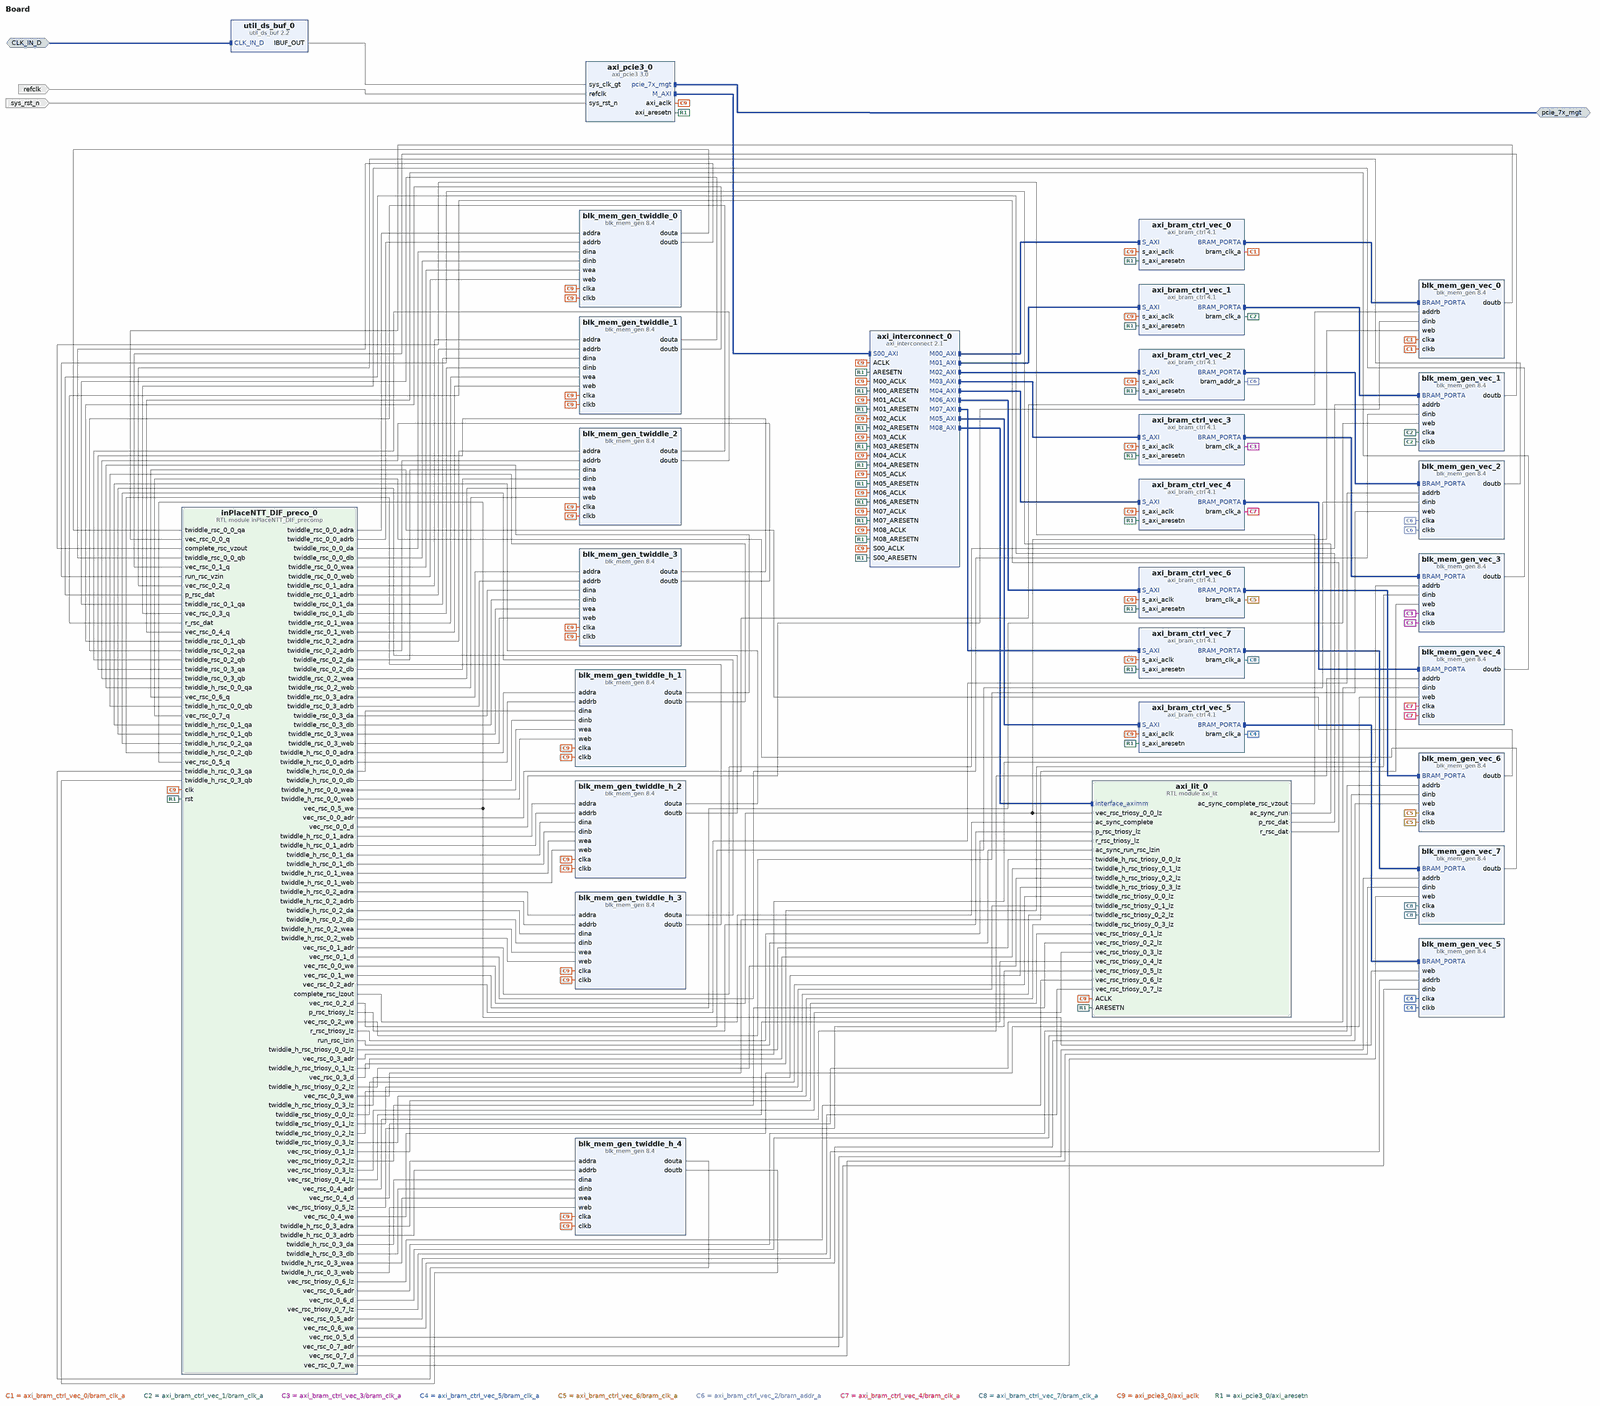
[diagram p0: block diagram of the top level, whole]
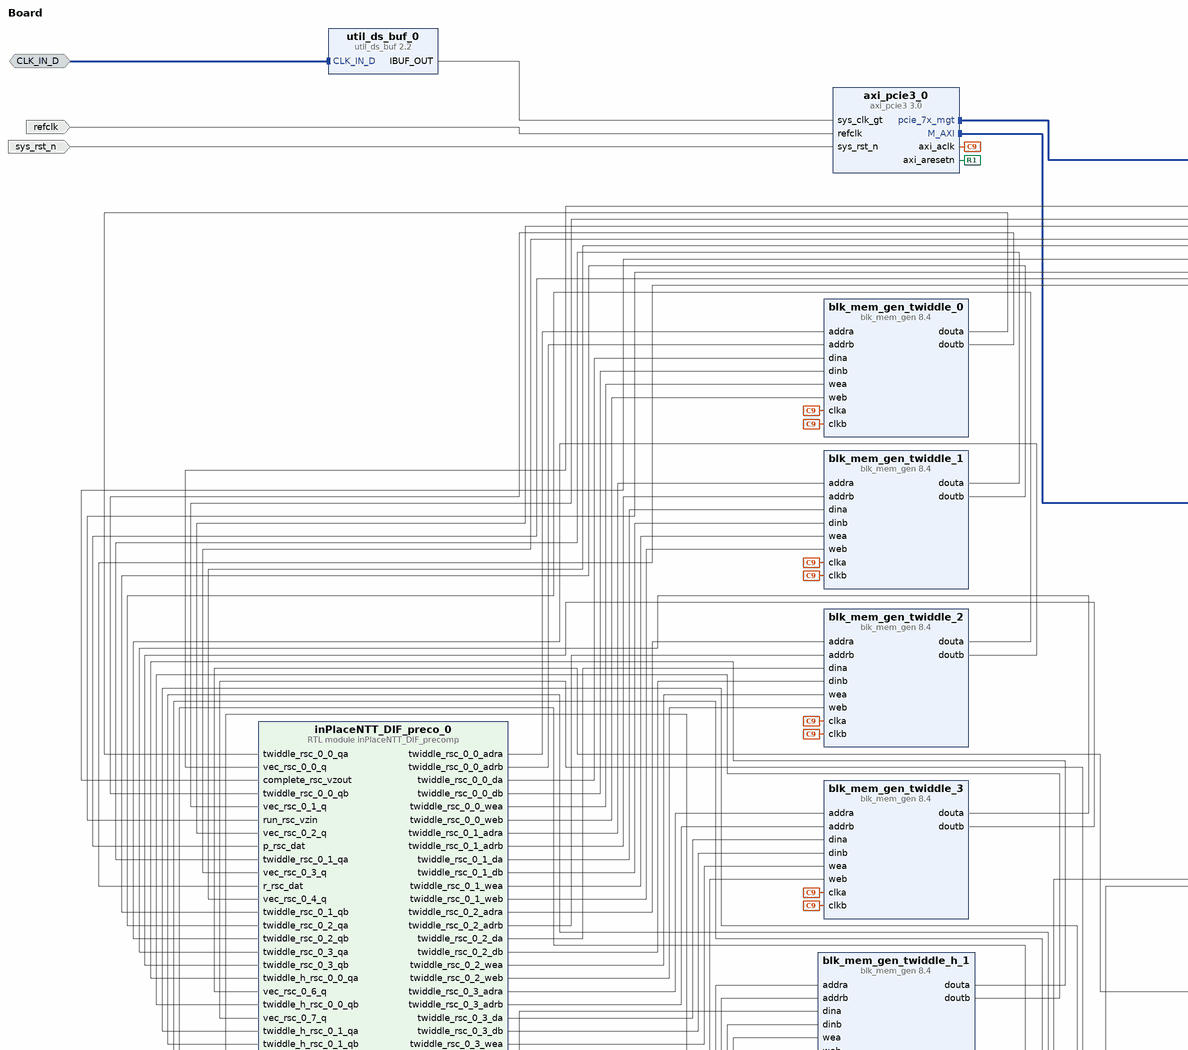
[diagram p1: block diagram of the top level, upper left part]
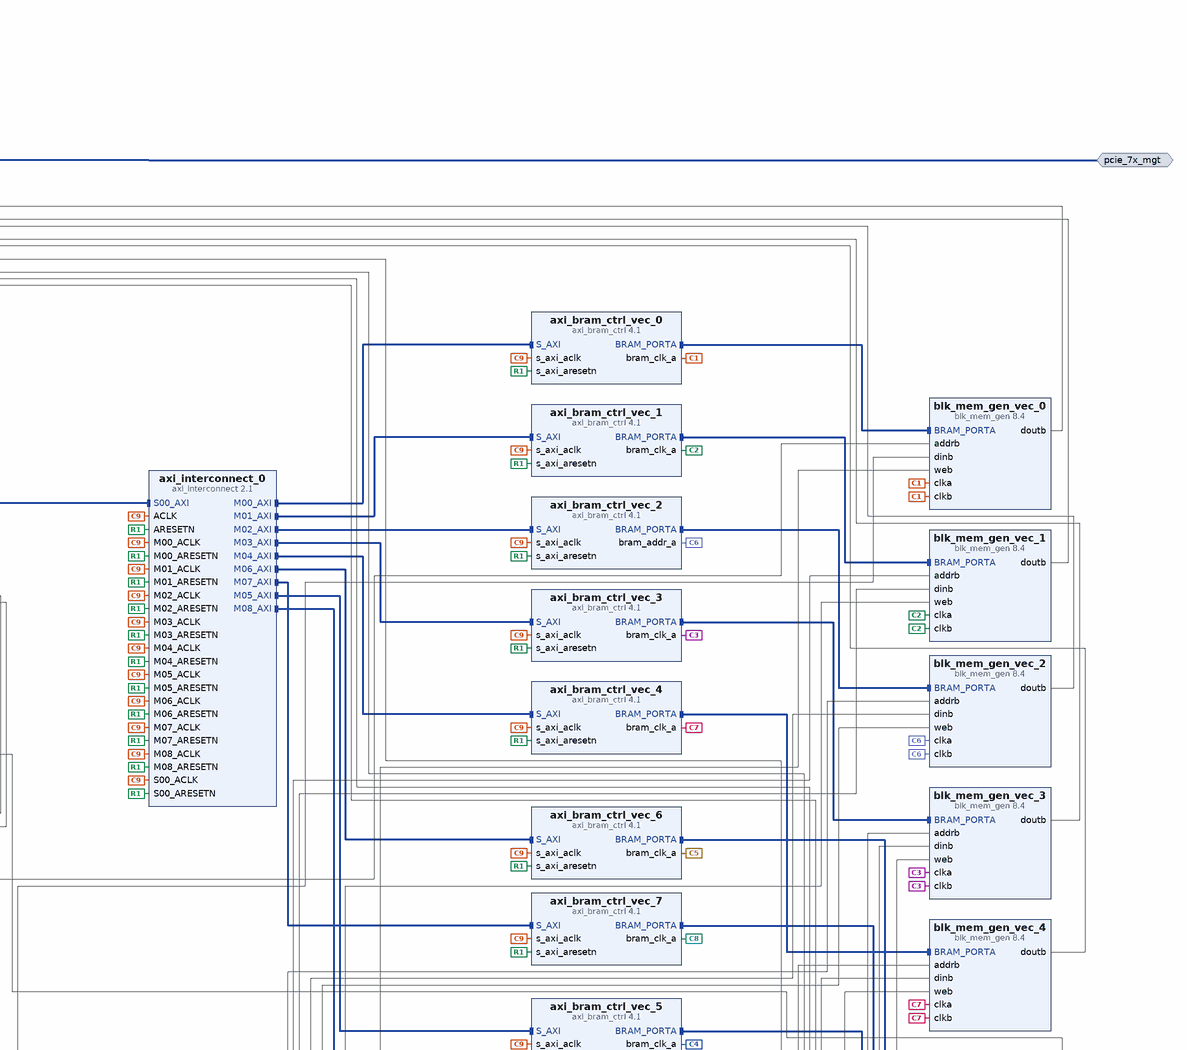
[diagram p2: block diagram of the top level, upper right part]
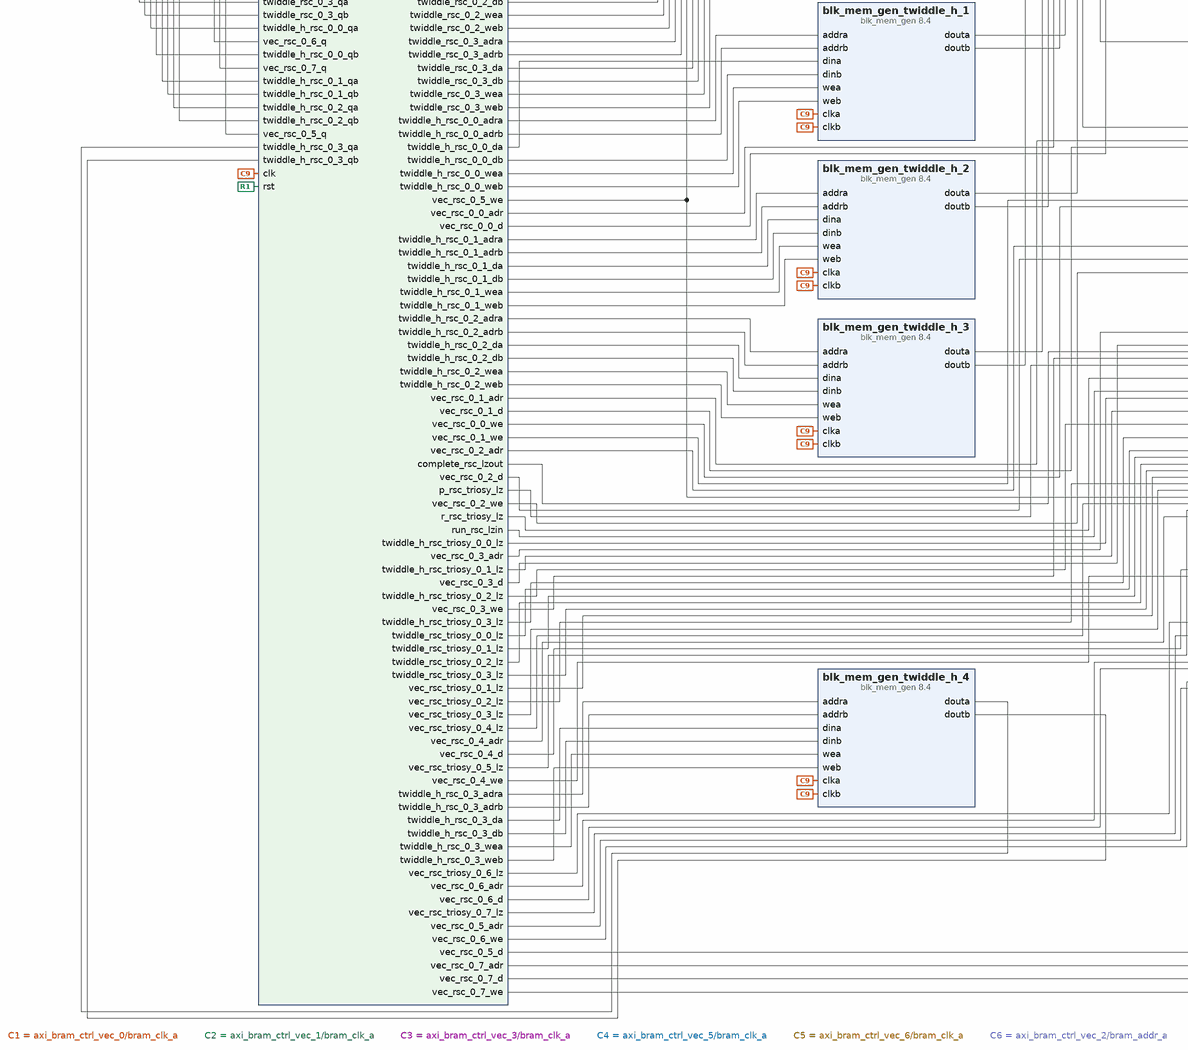
[diagram p3: block diagram of the top level, lower left part]
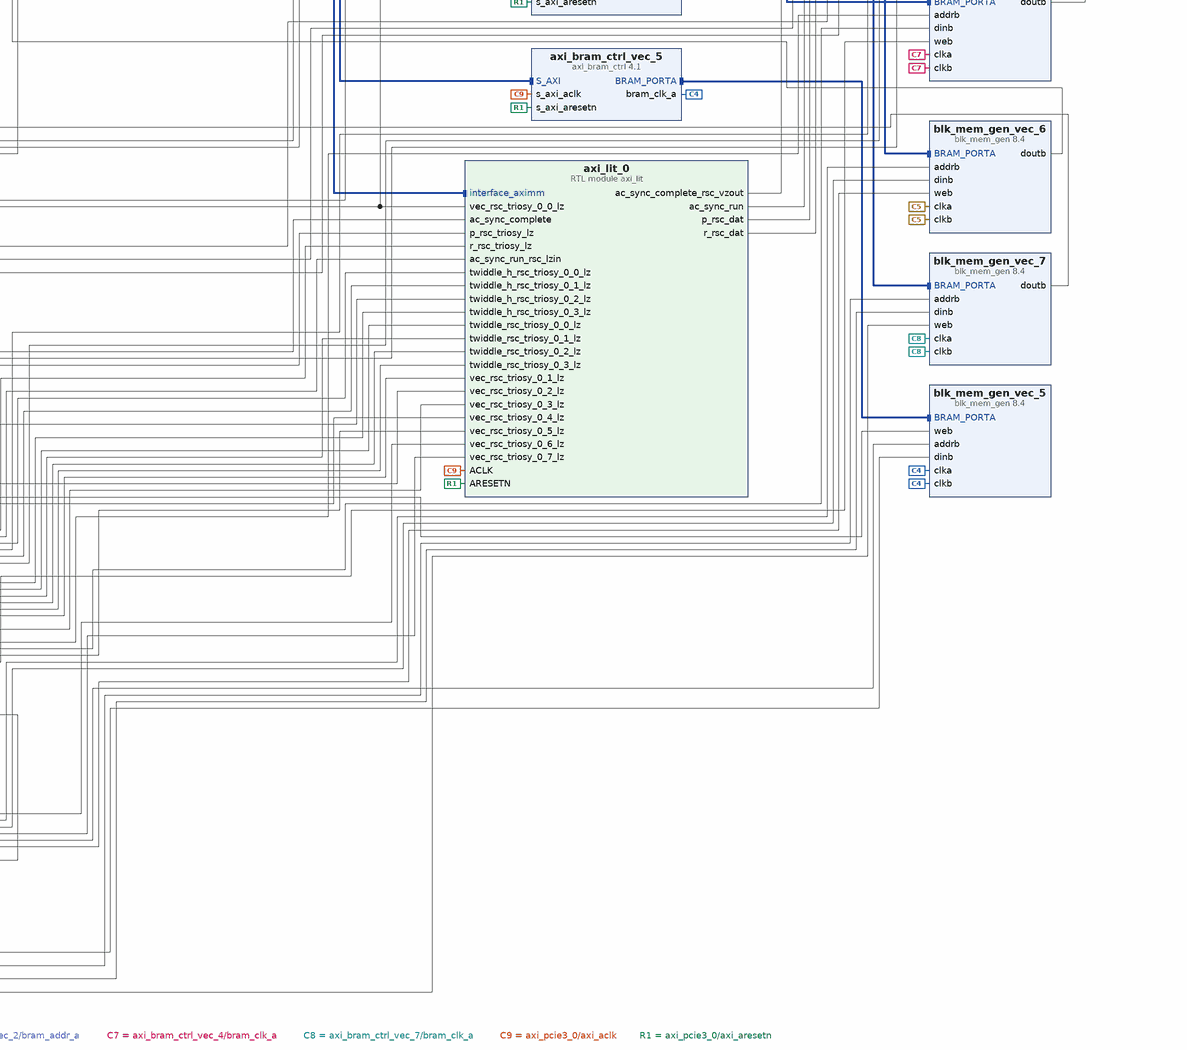
[diagram p4: block diagram of the top level, lower right part]
# Vivado block design Board, xcku115-flvb2104-2-e, Vivado 2021.1
create_bd_design Board

create_bd_intf_port -mode Master -vlnv xilinx.com:interface:pcie_7x_mgt_rtl:1.0 pcie_7x_mgt
create_bd_intf_port -mode Slave -vlnv xilinx.com:interface:diff_clock_rtl:1.0 CLK_IN_D
create_bd_port -dir I -type clk refclk
set_property -dict {CONFIG.FREQ_HZ 100000000} [get_bd_ports refclk]
create_bd_port -dir I -type rst sys_rst_n

create_bd_cell -type ip -vlnv xilinx.com:ip:axi_pcie3:3.0 axi_pcie3_0
create_bd_cell -type ip -vlnv xilinx.com:ip:axi_interconnect:2.1 axi_interconnect_0
set_property -dict {CONFIG.NUM_MI 9} [get_bd_cells axi_interconnect_0]
create_bd_cell -type ip -vlnv xilinx.com:ip:util_ds_buf:2.2 util_ds_buf_0
create_bd_cell -type ip -vlnv xilinx.com:ip:axi_bram_ctrl:4.1 axi_bram_ctrl_vec_0
set_property -dict {CONFIG.SINGLE_PORT_BRAM 1} [get_bd_cells axi_bram_ctrl_vec_0]
create_bd_cell -type ip -vlnv xilinx.com:ip:blk_mem_gen:8.4 blk_mem_gen_vec_0
set_property -dict [list \
  CONFIG.Enable_32bit_Address false \
  CONFIG.Enable_A Always_Enabled \
  CONFIG.Enable_B Always_Enabled \
  CONFIG.Memory_Type True_Dual_Port_RAM \
  CONFIG.Operating_Mode_A READ_FIRST \
  CONFIG.Operating_Mode_B READ_FIRST \
  CONFIG.Port_B_Clock 100 \
  CONFIG.Port_B_Enable_Rate 100 \
  CONFIG.Port_B_Write_Rate 50 \
  CONFIG.Register_PortA_Output_of_Memory_Primitives true \
  CONFIG.Register_PortB_Output_of_Memory_Primitives true \
  CONFIG.Use_Byte_Write_Enable false \
  CONFIG.Use_RSTA_Pin false \
  CONFIG.use_bram_block Stand_Alone \
] [get_bd_cells blk_mem_gen_vec_0]
create_bd_cell -type module -reference inPlaceNTT_DIF_precomp inPlaceNTT_DIF_preco_0
create_bd_cell -type ip -vlnv xilinx.com:ip:axi_bram_ctrl:4.1 axi_bram_ctrl_vec_1
set_property -dict {CONFIG.SINGLE_PORT_BRAM 1} [get_bd_cells axi_bram_ctrl_vec_1]
create_bd_cell -type ip -vlnv xilinx.com:ip:blk_mem_gen:8.4 blk_mem_gen_vec_1
set_property -dict [list \
  CONFIG.Enable_32bit_Address false \
  CONFIG.Enable_A Always_Enabled \
  CONFIG.Enable_B Always_Enabled \
  CONFIG.Memory_Type True_Dual_Port_RAM \
  CONFIG.Operating_Mode_A READ_FIRST \
  CONFIG.Operating_Mode_B READ_FIRST \
  CONFIG.Port_B_Clock 100 \
  CONFIG.Port_B_Enable_Rate 100 \
  CONFIG.Port_B_Write_Rate 50 \
  CONFIG.Register_PortA_Output_of_Memory_Primitives true \
  CONFIG.Register_PortB_Output_of_Memory_Primitives true \
  CONFIG.Use_Byte_Write_Enable false \
  CONFIG.Use_RSTA_Pin false \
  CONFIG.use_bram_block Stand_Alone \
] [get_bd_cells blk_mem_gen_vec_1]
create_bd_cell -type ip -vlnv xilinx.com:ip:axi_bram_ctrl:4.1 axi_bram_ctrl_vec_2
set_property -dict {CONFIG.SINGLE_PORT_BRAM 1} [get_bd_cells axi_bram_ctrl_vec_2]
create_bd_cell -type ip -vlnv xilinx.com:ip:blk_mem_gen:8.4 blk_mem_gen_vec_2
set_property -dict [list \
  CONFIG.Enable_32bit_Address false \
  CONFIG.Enable_A Always_Enabled \
  CONFIG.Enable_B Always_Enabled \
  CONFIG.Memory_Type True_Dual_Port_RAM \
  CONFIG.Operating_Mode_A READ_FIRST \
  CONFIG.Operating_Mode_B READ_FIRST \
  CONFIG.Port_B_Clock 100 \
  CONFIG.Port_B_Enable_Rate 100 \
  CONFIG.Port_B_Write_Rate 50 \
  CONFIG.Register_PortA_Output_of_Memory_Primitives true \
  CONFIG.Register_PortB_Output_of_Memory_Primitives true \
  CONFIG.Use_Byte_Write_Enable false \
  CONFIG.Use_RSTA_Pin false \
  CONFIG.use_bram_block Stand_Alone \
] [get_bd_cells blk_mem_gen_vec_2]
create_bd_cell -type ip -vlnv xilinx.com:ip:axi_bram_ctrl:4.1 axi_bram_ctrl_vec_3
set_property -dict {CONFIG.SINGLE_PORT_BRAM 1} [get_bd_cells axi_bram_ctrl_vec_3]
create_bd_cell -type ip -vlnv xilinx.com:ip:blk_mem_gen:8.4 blk_mem_gen_vec_3
set_property -dict [list \
  CONFIG.Enable_32bit_Address false \
  CONFIG.Enable_A Always_Enabled \
  CONFIG.Enable_B Always_Enabled \
  CONFIG.Memory_Type True_Dual_Port_RAM \
  CONFIG.Operating_Mode_A READ_FIRST \
  CONFIG.Operating_Mode_B READ_FIRST \
  CONFIG.Port_B_Clock 100 \
  CONFIG.Port_B_Enable_Rate 100 \
  CONFIG.Port_B_Write_Rate 50 \
  CONFIG.Register_PortA_Output_of_Memory_Primitives true \
  CONFIG.Register_PortB_Output_of_Memory_Primitives true \
  CONFIG.Use_Byte_Write_Enable false \
  CONFIG.Use_RSTA_Pin false \
  CONFIG.use_bram_block Stand_Alone \
] [get_bd_cells blk_mem_gen_vec_3]
create_bd_cell -type ip -vlnv xilinx.com:ip:axi_bram_ctrl:4.1 axi_bram_ctrl_vec_4
set_property -dict {CONFIG.SINGLE_PORT_BRAM 1} [get_bd_cells axi_bram_ctrl_vec_4]
create_bd_cell -type ip -vlnv xilinx.com:ip:blk_mem_gen:8.4 blk_mem_gen_vec_4
set_property -dict [list \
  CONFIG.Enable_32bit_Address false \
  CONFIG.Enable_A Always_Enabled \
  CONFIG.Enable_B Always_Enabled \
  CONFIG.Memory_Type True_Dual_Port_RAM \
  CONFIG.Operating_Mode_A READ_FIRST \
  CONFIG.Operating_Mode_B READ_FIRST \
  CONFIG.Port_B_Clock 100 \
  CONFIG.Port_B_Enable_Rate 100 \
  CONFIG.Port_B_Write_Rate 50 \
  CONFIG.Register_PortA_Output_of_Memory_Primitives true \
  CONFIG.Register_PortB_Output_of_Memory_Primitives true \
  CONFIG.Use_Byte_Write_Enable false \
  CONFIG.Use_RSTA_Pin false \
  CONFIG.use_bram_block Stand_Alone \
] [get_bd_cells blk_mem_gen_vec_4]
create_bd_cell -type ip -vlnv xilinx.com:ip:axi_bram_ctrl:4.1 axi_bram_ctrl_vec_5
set_property -dict {CONFIG.SINGLE_PORT_BRAM 1} [get_bd_cells axi_bram_ctrl_vec_5]
create_bd_cell -type ip -vlnv xilinx.com:ip:blk_mem_gen:8.4 blk_mem_gen_vec_5
set_property -dict [list \
  CONFIG.Enable_32bit_Address false \
  CONFIG.Enable_A Always_Enabled \
  CONFIG.Enable_B Always_Enabled \
  CONFIG.Memory_Type True_Dual_Port_RAM \
  CONFIG.Operating_Mode_A READ_FIRST \
  CONFIG.Operating_Mode_B READ_FIRST \
  CONFIG.Port_B_Clock 100 \
  CONFIG.Port_B_Enable_Rate 100 \
  CONFIG.Port_B_Write_Rate 50 \
  CONFIG.Register_PortA_Output_of_Memory_Primitives true \
  CONFIG.Register_PortB_Output_of_Memory_Primitives true \
  CONFIG.Use_Byte_Write_Enable false \
  CONFIG.Use_RSTA_Pin false \
  CONFIG.use_bram_block Stand_Alone \
] [get_bd_cells blk_mem_gen_vec_5]
create_bd_cell -type ip -vlnv xilinx.com:ip:axi_bram_ctrl:4.1 axi_bram_ctrl_vec_6
set_property -dict {CONFIG.SINGLE_PORT_BRAM 1} [get_bd_cells axi_bram_ctrl_vec_6]
create_bd_cell -type ip -vlnv xilinx.com:ip:blk_mem_gen:8.4 blk_mem_gen_vec_6
set_property -dict [list \
  CONFIG.Enable_32bit_Address false \
  CONFIG.Enable_A Always_Enabled \
  CONFIG.Enable_B Always_Enabled \
  CONFIG.Memory_Type True_Dual_Port_RAM \
  CONFIG.Operating_Mode_A READ_FIRST \
  CONFIG.Operating_Mode_B READ_FIRST \
  CONFIG.Port_B_Clock 100 \
  CONFIG.Port_B_Enable_Rate 100 \
  CONFIG.Port_B_Write_Rate 50 \
  CONFIG.Register_PortA_Output_of_Memory_Primitives true \
  CONFIG.Register_PortB_Output_of_Memory_Primitives true \
  CONFIG.Use_Byte_Write_Enable false \
  CONFIG.Use_RSTA_Pin false \
  CONFIG.use_bram_block Stand_Alone \
] [get_bd_cells blk_mem_gen_vec_6]
create_bd_cell -type ip -vlnv xilinx.com:ip:axi_bram_ctrl:4.1 axi_bram_ctrl_vec_7
set_property -dict {CONFIG.SINGLE_PORT_BRAM 1} [get_bd_cells axi_bram_ctrl_vec_7]
create_bd_cell -type ip -vlnv xilinx.com:ip:blk_mem_gen:8.4 blk_mem_gen_vec_7
set_property -dict [list \
  CONFIG.Enable_32bit_Address false \
  CONFIG.Enable_A Always_Enabled \
  CONFIG.Enable_B Always_Enabled \
  CONFIG.Memory_Type True_Dual_Port_RAM \
  CONFIG.Operating_Mode_A READ_FIRST \
  CONFIG.Operating_Mode_B READ_FIRST \
  CONFIG.Port_B_Clock 100 \
  CONFIG.Port_B_Enable_Rate 100 \
  CONFIG.Port_B_Write_Rate 50 \
  CONFIG.Register_PortA_Output_of_Memory_Primitives true \
  CONFIG.Register_PortB_Output_of_Memory_Primitives true \
  CONFIG.Use_Byte_Write_Enable false \
  CONFIG.Use_RSTA_Pin false \
  CONFIG.use_bram_block Stand_Alone \
] [get_bd_cells blk_mem_gen_vec_7]
create_bd_cell -type ip -vlnv xilinx.com:ip:blk_mem_gen:8.4 blk_mem_gen_twiddle_0
set_property -dict [list \
  CONFIG.Enable_32bit_Address false \
  CONFIG.Enable_A Always_Enabled \
  CONFIG.Enable_B Always_Enabled \
  CONFIG.Memory_Type True_Dual_Port_RAM \
  CONFIG.Operating_Mode_A READ_FIRST \
  CONFIG.Operating_Mode_B READ_FIRST \
  CONFIG.Port_B_Clock 100 \
  CONFIG.Port_B_Enable_Rate 100 \
  CONFIG.Port_B_Write_Rate 50 \
  CONFIG.Register_PortA_Output_of_Memory_Primitives true \
  CONFIG.Register_PortB_Output_of_Memory_Primitives true \
  CONFIG.Use_Byte_Write_Enable false \
  CONFIG.Use_RSTA_Pin false \
  CONFIG.use_bram_block Stand_Alone \
] [get_bd_cells blk_mem_gen_twiddle_0]
create_bd_cell -type ip -vlnv xilinx.com:ip:blk_mem_gen:8.4 blk_mem_gen_twiddle_1
set_property -dict [list \
  CONFIG.Enable_32bit_Address false \
  CONFIG.Enable_A Always_Enabled \
  CONFIG.Enable_B Always_Enabled \
  CONFIG.Memory_Type True_Dual_Port_RAM \
  CONFIG.Operating_Mode_A READ_FIRST \
  CONFIG.Operating_Mode_B READ_FIRST \
  CONFIG.Port_B_Clock 100 \
  CONFIG.Port_B_Enable_Rate 100 \
  CONFIG.Port_B_Write_Rate 50 \
  CONFIG.Register_PortA_Output_of_Memory_Primitives true \
  CONFIG.Register_PortB_Output_of_Memory_Primitives true \
  CONFIG.Use_Byte_Write_Enable false \
  CONFIG.Use_RSTA_Pin false \
  CONFIG.use_bram_block Stand_Alone \
] [get_bd_cells blk_mem_gen_twiddle_1]
create_bd_cell -type ip -vlnv xilinx.com:ip:blk_mem_gen:8.4 blk_mem_gen_twiddle_2
set_property -dict [list \
  CONFIG.Enable_32bit_Address false \
  CONFIG.Enable_A Always_Enabled \
  CONFIG.Enable_B Always_Enabled \
  CONFIG.Memory_Type True_Dual_Port_RAM \
  CONFIG.Operating_Mode_A READ_FIRST \
  CONFIG.Operating_Mode_B READ_FIRST \
  CONFIG.Port_B_Clock 100 \
  CONFIG.Port_B_Enable_Rate 100 \
  CONFIG.Port_B_Write_Rate 50 \
  CONFIG.Register_PortA_Output_of_Memory_Primitives true \
  CONFIG.Register_PortB_Output_of_Memory_Primitives true \
  CONFIG.Use_Byte_Write_Enable false \
  CONFIG.Use_RSTA_Pin false \
  CONFIG.use_bram_block Stand_Alone \
] [get_bd_cells blk_mem_gen_twiddle_2]
create_bd_cell -type ip -vlnv xilinx.com:ip:blk_mem_gen:8.4 blk_mem_gen_twiddle_3
set_property -dict [list \
  CONFIG.Enable_32bit_Address false \
  CONFIG.Enable_A Always_Enabled \
  CONFIG.Enable_B Always_Enabled \
  CONFIG.Memory_Type True_Dual_Port_RAM \
  CONFIG.Operating_Mode_A READ_FIRST \
  CONFIG.Operating_Mode_B READ_FIRST \
  CONFIG.Port_B_Clock 100 \
  CONFIG.Port_B_Enable_Rate 100 \
  CONFIG.Port_B_Write_Rate 50 \
  CONFIG.Register_PortA_Output_of_Memory_Primitives true \
  CONFIG.Register_PortB_Output_of_Memory_Primitives true \
  CONFIG.Use_Byte_Write_Enable false \
  CONFIG.Use_RSTA_Pin false \
  CONFIG.use_bram_block Stand_Alone \
] [get_bd_cells blk_mem_gen_twiddle_3]
create_bd_cell -type ip -vlnv xilinx.com:ip:blk_mem_gen:8.4 blk_mem_gen_twiddle_h_1
set_property -dict [list \
  CONFIG.Enable_32bit_Address false \
  CONFIG.Enable_A Always_Enabled \
  CONFIG.Enable_B Always_Enabled \
  CONFIG.Memory_Type True_Dual_Port_RAM \
  CONFIG.Operating_Mode_A READ_FIRST \
  CONFIG.Operating_Mode_B READ_FIRST \
  CONFIG.Port_B_Clock 100 \
  CONFIG.Port_B_Enable_Rate 100 \
  CONFIG.Port_B_Write_Rate 50 \
  CONFIG.Register_PortA_Output_of_Memory_Primitives true \
  CONFIG.Register_PortB_Output_of_Memory_Primitives true \
  CONFIG.Use_Byte_Write_Enable false \
  CONFIG.Use_RSTA_Pin false \
  CONFIG.use_bram_block Stand_Alone \
] [get_bd_cells blk_mem_gen_twiddle_h_1]
create_bd_cell -type ip -vlnv xilinx.com:ip:blk_mem_gen:8.4 blk_mem_gen_twiddle_h_2
set_property -dict [list \
  CONFIG.Enable_32bit_Address false \
  CONFIG.Enable_A Always_Enabled \
  CONFIG.Enable_B Always_Enabled \
  CONFIG.Memory_Type True_Dual_Port_RAM \
  CONFIG.Operating_Mode_A READ_FIRST \
  CONFIG.Operating_Mode_B READ_FIRST \
  CONFIG.Port_B_Clock 100 \
  CONFIG.Port_B_Enable_Rate 100 \
  CONFIG.Port_B_Write_Rate 50 \
  CONFIG.Register_PortA_Output_of_Memory_Primitives true \
  CONFIG.Register_PortB_Output_of_Memory_Primitives true \
  CONFIG.Use_Byte_Write_Enable false \
  CONFIG.Use_RSTA_Pin false \
  CONFIG.use_bram_block Stand_Alone \
] [get_bd_cells blk_mem_gen_twiddle_h_2]
create_bd_cell -type ip -vlnv xilinx.com:ip:blk_mem_gen:8.4 blk_mem_gen_twiddle_h_3
set_property -dict [list \
  CONFIG.Enable_32bit_Address false \
  CONFIG.Enable_A Always_Enabled \
  CONFIG.Enable_B Always_Enabled \
  CONFIG.Memory_Type True_Dual_Port_RAM \
  CONFIG.Operating_Mode_A READ_FIRST \
  CONFIG.Operating_Mode_B READ_FIRST \
  CONFIG.Port_B_Clock 100 \
  CONFIG.Port_B_Enable_Rate 100 \
  CONFIG.Port_B_Write_Rate 50 \
  CONFIG.Register_PortA_Output_of_Memory_Primitives true \
  CONFIG.Register_PortB_Output_of_Memory_Primitives true \
  CONFIG.Use_Byte_Write_Enable false \
  CONFIG.Use_RSTA_Pin false \
  CONFIG.use_bram_block Stand_Alone \
] [get_bd_cells blk_mem_gen_twiddle_h_3]
create_bd_cell -type ip -vlnv xilinx.com:ip:blk_mem_gen:8.4 blk_mem_gen_twiddle_h_4
set_property -dict [list \
  CONFIG.Enable_32bit_Address false \
  CONFIG.Enable_A Always_Enabled \
  CONFIG.Enable_B Always_Enabled \
  CONFIG.Memory_Type True_Dual_Port_RAM \
  CONFIG.Operating_Mode_A READ_FIRST \
  CONFIG.Operating_Mode_B READ_FIRST \
  CONFIG.Port_B_Clock 100 \
  CONFIG.Port_B_Enable_Rate 100 \
  CONFIG.Port_B_Write_Rate 50 \
  CONFIG.Register_PortA_Output_of_Memory_Primitives true \
  CONFIG.Register_PortB_Output_of_Memory_Primitives true \
  CONFIG.Use_Byte_Write_Enable false \
  CONFIG.Use_RSTA_Pin false \
  CONFIG.use_bram_block Stand_Alone \
] [get_bd_cells blk_mem_gen_twiddle_h_4]
create_bd_cell -type module -reference axi_lit axi_lit_0

# ---- connections ----

connect_bd_intf_net [get_bd_intf_ports CLK_IN_D] [get_bd_intf_pins util_ds_buf_0/CLK_IN_D]
connect_bd_intf_net -intf_net axi_bram_ctrl_0_BRAM_PORTA [get_bd_intf_pins blk_mem_gen_vec_0/BRAM_PORTA] [get_bd_intf_pins axi_bram_ctrl_vec_0/BRAM_PORTA]
connect_bd_intf_net [get_bd_intf_pins axi_bram_ctrl_vec_1/BRAM_PORTA] [get_bd_intf_pins blk_mem_gen_vec_1/BRAM_PORTA]
connect_bd_intf_net [get_bd_intf_pins axi_bram_ctrl_vec_2/BRAM_PORTA] [get_bd_intf_pins blk_mem_gen_vec_2/BRAM_PORTA]
connect_bd_intf_net [get_bd_intf_pins axi_bram_ctrl_vec_3/BRAM_PORTA] [get_bd_intf_pins blk_mem_gen_vec_3/BRAM_PORTA]
connect_bd_intf_net [get_bd_intf_pins axi_bram_ctrl_vec_4/BRAM_PORTA] [get_bd_intf_pins blk_mem_gen_vec_4/BRAM_PORTA]
connect_bd_intf_net [get_bd_intf_pins blk_mem_gen_vec_5/BRAM_PORTA] [get_bd_intf_pins axi_bram_ctrl_vec_5/BRAM_PORTA]
connect_bd_intf_net [get_bd_intf_pins axi_bram_ctrl_vec_6/BRAM_PORTA] [get_bd_intf_pins blk_mem_gen_vec_6/BRAM_PORTA]
connect_bd_intf_net [get_bd_intf_pins blk_mem_gen_vec_7/BRAM_PORTA] [get_bd_intf_pins axi_bram_ctrl_vec_7/BRAM_PORTA]
connect_bd_intf_net [get_bd_intf_pins axi_interconnect_0/M00_AXI] [get_bd_intf_pins axi_bram_ctrl_vec_0/S_AXI]
connect_bd_intf_net [get_bd_intf_pins axi_interconnect_0/M01_AXI] [get_bd_intf_pins axi_bram_ctrl_vec_1/S_AXI]
connect_bd_intf_net [get_bd_intf_pins axi_interconnect_0/M02_AXI] [get_bd_intf_pins axi_bram_ctrl_vec_2/S_AXI]
connect_bd_intf_net [get_bd_intf_pins axi_bram_ctrl_vec_3/S_AXI] [get_bd_intf_pins axi_interconnect_0/M03_AXI]
connect_bd_intf_net [get_bd_intf_pins axi_bram_ctrl_vec_4/S_AXI] [get_bd_intf_pins axi_interconnect_0/M04_AXI]
connect_bd_intf_net [get_bd_intf_pins axi_interconnect_0/M05_AXI] [get_bd_intf_pins axi_bram_ctrl_vec_5/S_AXI]
connect_bd_intf_net [get_bd_intf_pins axi_interconnect_0/M06_AXI] [get_bd_intf_pins axi_bram_ctrl_vec_6/S_AXI]
connect_bd_intf_net [get_bd_intf_pins axi_interconnect_0/M07_AXI] [get_bd_intf_pins axi_bram_ctrl_vec_7/S_AXI]
connect_bd_intf_net [get_bd_intf_pins axi_interconnect_0/M08_AXI] [get_bd_intf_pins axi_lit_0/interface_aximm]
connect_bd_intf_net [get_bd_intf_pins axi_pcie3_0/M_AXI] [get_bd_intf_pins axi_interconnect_0/S00_AXI]
connect_bd_intf_net [get_bd_intf_ports pcie_7x_mgt] [get_bd_intf_pins axi_pcie3_0/pcie_7x_mgt]
connect_bd_net [get_bd_pins axi_bram_ctrl_vec_0/bram_clk_a] [get_bd_pins blk_mem_gen_vec_0/clkb] [get_bd_pins blk_mem_gen_vec_0/clka]
connect_bd_net [get_bd_pins axi_bram_ctrl_vec_1/bram_clk_a] [get_bd_pins blk_mem_gen_vec_1/clkb] [get_bd_pins blk_mem_gen_vec_1/clka]
connect_bd_net [get_bd_pins axi_bram_ctrl_vec_3/bram_clk_a] [get_bd_pins blk_mem_gen_vec_3/clkb] [get_bd_pins blk_mem_gen_vec_3/clka]
connect_bd_net [get_bd_pins axi_bram_ctrl_vec_5/bram_clk_a] [get_bd_pins blk_mem_gen_vec_5/clkb] [get_bd_pins blk_mem_gen_vec_5/clka]
connect_bd_net [get_bd_pins axi_bram_ctrl_vec_6/bram_clk_a] [get_bd_pins blk_mem_gen_vec_6/clkb] [get_bd_pins blk_mem_gen_vec_6/clka]
connect_bd_net [get_bd_pins axi_bram_ctrl_vec_2/bram_addr_a] [get_bd_pins blk_mem_gen_vec_2/clkb] [get_bd_pins blk_mem_gen_vec_2/clka]
connect_bd_net [get_bd_pins axi_bram_ctrl_vec_4/bram_clk_a] [get_bd_pins blk_mem_gen_vec_4/clka] [get_bd_pins blk_mem_gen_vec_4/clkb]
connect_bd_net [get_bd_pins axi_bram_ctrl_vec_7/bram_clk_a] [get_bd_pins blk_mem_gen_vec_7/clka] [get_bd_pins blk_mem_gen_vec_7/clkb]
connect_bd_net [get_bd_pins axi_lit_0/ac_sync_complete_rsc_vzout] [get_bd_pins inPlaceNTT_DIF_preco_0/complete_rsc_vzout]
connect_bd_net [get_bd_pins axi_lit_0/ac_sync_run] [get_bd_pins inPlaceNTT_DIF_preco_0/run_rsc_vzin]
connect_bd_net [get_bd_pins axi_lit_0/p_rsc_dat] [get_bd_pins inPlaceNTT_DIF_preco_0/p_rsc_dat]
connect_bd_net [get_bd_pins axi_lit_0/r_rsc_dat] [get_bd_pins inPlaceNTT_DIF_preco_0/r_rsc_dat]
connect_bd_net [get_bd_pins axi_pcie3_0/axi_aclk] \
  [get_bd_pins inPlaceNTT_DIF_preco_0/clk] [get_bd_pins axi_interconnect_0/ACLK] [get_bd_pins axi_interconnect_0/S00_ACLK] \
  [get_bd_pins axi_interconnect_0/M00_ACLK] [get_bd_pins axi_interconnect_0/M01_ACLK] \
  [get_bd_pins axi_bram_ctrl_vec_1/s_axi_aclk] [get_bd_pins axi_bram_ctrl_vec_0/s_axi_aclk] \
  [get_bd_pins axi_interconnect_0/M02_ACLK] [get_bd_pins axi_interconnect_0/M03_ACLK] \
  [get_bd_pins axi_interconnect_0/M04_ACLK] [get_bd_pins axi_interconnect_0/M05_ACLK] \
  [get_bd_pins axi_interconnect_0/M06_ACLK] [get_bd_pins axi_interconnect_0/M07_ACLK] \
  [get_bd_pins axi_interconnect_0/M08_ACLK] [get_bd_pins axi_bram_ctrl_vec_2/s_axi_aclk] \
  [get_bd_pins axi_bram_ctrl_vec_3/s_axi_aclk] [get_bd_pins axi_bram_ctrl_vec_4/s_axi_aclk] \
  [get_bd_pins axi_bram_ctrl_vec_5/s_axi_aclk] [get_bd_pins axi_bram_ctrl_vec_6/s_axi_aclk] \
  [get_bd_pins axi_bram_ctrl_vec_7/s_axi_aclk] [get_bd_pins blk_mem_gen_twiddle_0/clka] \
  [get_bd_pins blk_mem_gen_twiddle_0/clkb] [get_bd_pins blk_mem_gen_twiddle_1/clka] [get_bd_pins blk_mem_gen_twiddle_1/clkb] \
  [get_bd_pins blk_mem_gen_twiddle_2/clka] [get_bd_pins blk_mem_gen_twiddle_2/clkb] [get_bd_pins blk_mem_gen_twiddle_3/clka] \
  [get_bd_pins blk_mem_gen_twiddle_3/clkb] [get_bd_pins blk_mem_gen_twiddle_h_1/clka] \
  [get_bd_pins blk_mem_gen_twiddle_h_1/clkb] [get_bd_pins blk_mem_gen_twiddle_h_2/clka] \
  [get_bd_pins blk_mem_gen_twiddle_h_2/clkb] [get_bd_pins blk_mem_gen_twiddle_h_3/clka] \
  [get_bd_pins blk_mem_gen_twiddle_h_3/clkb] [get_bd_pins blk_mem_gen_twiddle_h_4/clka] \
  [get_bd_pins blk_mem_gen_twiddle_h_4/clkb] [get_bd_pins axi_lit_0/ACLK]
connect_bd_net [get_bd_pins axi_pcie3_0/axi_aresetn] \
  [get_bd_pins inPlaceNTT_DIF_preco_0/rst] [get_bd_pins axi_interconnect_0/ARESETN] \
  [get_bd_pins axi_interconnect_0/S00_ARESETN] [get_bd_pins axi_interconnect_0/M00_ARESETN] \
  [get_bd_pins axi_interconnect_0/M01_ARESETN] [get_bd_pins axi_bram_ctrl_vec_0/s_axi_aresetn] \
  [get_bd_pins axi_bram_ctrl_vec_1/s_axi_aresetn] [get_bd_pins axi_interconnect_0/M02_ARESETN] \
  [get_bd_pins axi_interconnect_0/M03_ARESETN] [get_bd_pins axi_interconnect_0/M04_ARESETN] \
  [get_bd_pins axi_interconnect_0/M05_ARESETN] [get_bd_pins axi_interconnect_0/M06_ARESETN] \
  [get_bd_pins axi_interconnect_0/M07_ARESETN] [get_bd_pins axi_interconnect_0/M08_ARESETN] \
  [get_bd_pins axi_bram_ctrl_vec_2/s_axi_aresetn] [get_bd_pins axi_bram_ctrl_vec_3/s_axi_aresetn] \
  [get_bd_pins axi_bram_ctrl_vec_4/s_axi_aresetn] [get_bd_pins axi_bram_ctrl_vec_5/s_axi_aresetn] \
  [get_bd_pins axi_bram_ctrl_vec_6/s_axi_aresetn] [get_bd_pins axi_bram_ctrl_vec_7/s_axi_aresetn] \
  [get_bd_pins axi_lit_0/ARESETN]
connect_bd_net [get_bd_pins blk_mem_gen_twiddle_0/douta] [get_bd_pins inPlaceNTT_DIF_preco_0/twiddle_rsc_0_0_qa]
connect_bd_net [get_bd_pins blk_mem_gen_twiddle_0/doutb] [get_bd_pins inPlaceNTT_DIF_preco_0/twiddle_rsc_0_0_qb]
connect_bd_net [get_bd_pins blk_mem_gen_twiddle_1/douta] [get_bd_pins inPlaceNTT_DIF_preco_0/twiddle_rsc_0_1_qa]
connect_bd_net [get_bd_pins blk_mem_gen_twiddle_1/doutb] [get_bd_pins inPlaceNTT_DIF_preco_0/twiddle_rsc_0_1_qb]
connect_bd_net [get_bd_pins blk_mem_gen_twiddle_2/douta] [get_bd_pins inPlaceNTT_DIF_preco_0/twiddle_rsc_0_2_qa]
connect_bd_net [get_bd_pins blk_mem_gen_twiddle_2/doutb] [get_bd_pins inPlaceNTT_DIF_preco_0/twiddle_rsc_0_2_qb]
connect_bd_net [get_bd_pins blk_mem_gen_twiddle_3/douta] [get_bd_pins inPlaceNTT_DIF_preco_0/twiddle_rsc_0_3_qa]
connect_bd_net [get_bd_pins blk_mem_gen_twiddle_3/doutb] [get_bd_pins inPlaceNTT_DIF_preco_0/twiddle_rsc_0_3_qb]
connect_bd_net [get_bd_pins blk_mem_gen_twiddle_h_1/douta] [get_bd_pins inPlaceNTT_DIF_preco_0/twiddle_h_rsc_0_0_qa]
connect_bd_net [get_bd_pins blk_mem_gen_twiddle_h_1/doutb] [get_bd_pins inPlaceNTT_DIF_preco_0/twiddle_h_rsc_0_0_qb]
connect_bd_net [get_bd_pins blk_mem_gen_twiddle_h_2/douta] [get_bd_pins inPlaceNTT_DIF_preco_0/twiddle_h_rsc_0_1_qa]
connect_bd_net [get_bd_pins blk_mem_gen_twiddle_h_2/doutb] [get_bd_pins inPlaceNTT_DIF_preco_0/twiddle_h_rsc_0_1_qb]
connect_bd_net [get_bd_pins blk_mem_gen_twiddle_h_3/douta] [get_bd_pins inPlaceNTT_DIF_preco_0/twiddle_h_rsc_0_2_qa]
connect_bd_net [get_bd_pins blk_mem_gen_twiddle_h_3/doutb] [get_bd_pins inPlaceNTT_DIF_preco_0/twiddle_h_rsc_0_2_qb]
connect_bd_net [get_bd_pins blk_mem_gen_twiddle_h_4/douta] [get_bd_pins inPlaceNTT_DIF_preco_0/twiddle_h_rsc_0_3_qa]
connect_bd_net [get_bd_pins blk_mem_gen_twiddle_h_4/doutb] [get_bd_pins inPlaceNTT_DIF_preco_0/twiddle_h_rsc_0_3_qb]
connect_bd_net [get_bd_pins blk_mem_gen_vec_0/doutb] [get_bd_pins inPlaceNTT_DIF_preco_0/vec_rsc_0_0_q]
connect_bd_net [get_bd_pins blk_mem_gen_vec_1/doutb] [get_bd_pins inPlaceNTT_DIF_preco_0/vec_rsc_0_1_q]
connect_bd_net [get_bd_pins blk_mem_gen_vec_2/doutb] [get_bd_pins inPlaceNTT_DIF_preco_0/vec_rsc_0_2_q]
connect_bd_net [get_bd_pins blk_mem_gen_vec_3/doutb] [get_bd_pins inPlaceNTT_DIF_preco_0/vec_rsc_0_3_q]
connect_bd_net [get_bd_pins blk_mem_gen_vec_4/doutb] [get_bd_pins inPlaceNTT_DIF_preco_0/vec_rsc_0_4_q]
connect_bd_net [get_bd_pins blk_mem_gen_vec_6/doutb] [get_bd_pins inPlaceNTT_DIF_preco_0/vec_rsc_0_6_q]
connect_bd_net [get_bd_pins blk_mem_gen_vec_7/doutb] [get_bd_pins inPlaceNTT_DIF_preco_0/vec_rsc_0_7_q]
connect_bd_net [get_bd_pins inPlaceNTT_DIF_preco_0/complete_rsc_lzout] [get_bd_pins axi_lit_0/ac_sync_complete]
connect_bd_net [get_bd_pins inPlaceNTT_DIF_preco_0/p_rsc_triosy_lz] [get_bd_pins axi_lit_0/p_rsc_triosy_lz]
connect_bd_net [get_bd_pins inPlaceNTT_DIF_preco_0/r_rsc_triosy_lz] [get_bd_pins axi_lit_0/r_rsc_triosy_lz]
connect_bd_net [get_bd_pins inPlaceNTT_DIF_preco_0/run_rsc_lzin] [get_bd_pins axi_lit_0/ac_sync_run_rsc_lzin]
connect_bd_net [get_bd_pins inPlaceNTT_DIF_preco_0/twiddle_h_rsc_0_0_adra] [get_bd_pins blk_mem_gen_twiddle_h_1/addra]
connect_bd_net [get_bd_pins inPlaceNTT_DIF_preco_0/twiddle_h_rsc_0_0_adrb] [get_bd_pins blk_mem_gen_twiddle_h_1/addrb]
connect_bd_net [get_bd_pins inPlaceNTT_DIF_preco_0/twiddle_h_rsc_0_0_da] [get_bd_pins blk_mem_gen_twiddle_h_1/dina]
connect_bd_net [get_bd_pins inPlaceNTT_DIF_preco_0/twiddle_h_rsc_0_0_db] [get_bd_pins blk_mem_gen_twiddle_h_1/dinb]
connect_bd_net [get_bd_pins inPlaceNTT_DIF_preco_0/twiddle_h_rsc_0_0_wea] [get_bd_pins blk_mem_gen_twiddle_h_1/wea]
connect_bd_net [get_bd_pins inPlaceNTT_DIF_preco_0/twiddle_h_rsc_0_0_web] [get_bd_pins blk_mem_gen_twiddle_h_1/web]
connect_bd_net [get_bd_pins inPlaceNTT_DIF_preco_0/twiddle_h_rsc_0_1_adra] [get_bd_pins blk_mem_gen_twiddle_h_2/addra]
connect_bd_net [get_bd_pins inPlaceNTT_DIF_preco_0/twiddle_h_rsc_0_1_adrb] [get_bd_pins blk_mem_gen_twiddle_h_2/addrb]
connect_bd_net [get_bd_pins inPlaceNTT_DIF_preco_0/twiddle_h_rsc_0_1_da] [get_bd_pins blk_mem_gen_twiddle_h_2/dina]
connect_bd_net [get_bd_pins inPlaceNTT_DIF_preco_0/twiddle_h_rsc_0_1_db] [get_bd_pins blk_mem_gen_twiddle_h_2/dinb]
connect_bd_net [get_bd_pins inPlaceNTT_DIF_preco_0/twiddle_h_rsc_0_1_wea] [get_bd_pins blk_mem_gen_twiddle_h_2/wea]
connect_bd_net [get_bd_pins inPlaceNTT_DIF_preco_0/twiddle_h_rsc_0_1_web] [get_bd_pins blk_mem_gen_twiddle_h_2/web]
connect_bd_net [get_bd_pins inPlaceNTT_DIF_preco_0/twiddle_h_rsc_0_2_adra] [get_bd_pins blk_mem_gen_twiddle_h_3/addra]
connect_bd_net [get_bd_pins inPlaceNTT_DIF_preco_0/twiddle_h_rsc_0_2_adrb] [get_bd_pins blk_mem_gen_twiddle_h_3/addrb]
connect_bd_net [get_bd_pins inPlaceNTT_DIF_preco_0/twiddle_h_rsc_0_2_da] [get_bd_pins blk_mem_gen_twiddle_h_3/dina]
connect_bd_net [get_bd_pins inPlaceNTT_DIF_preco_0/twiddle_h_rsc_0_2_db] [get_bd_pins blk_mem_gen_twiddle_h_3/dinb]
connect_bd_net [get_bd_pins inPlaceNTT_DIF_preco_0/twiddle_h_rsc_0_2_wea] [get_bd_pins blk_mem_gen_twiddle_h_3/wea]
connect_bd_net [get_bd_pins inPlaceNTT_DIF_preco_0/twiddle_h_rsc_0_2_web] [get_bd_pins blk_mem_gen_twiddle_h_3/web]
connect_bd_net [get_bd_pins inPlaceNTT_DIF_preco_0/twiddle_h_rsc_0_3_adra] [get_bd_pins blk_mem_gen_twiddle_h_4/addra]
connect_bd_net [get_bd_pins inPlaceNTT_DIF_preco_0/twiddle_h_rsc_0_3_adrb] [get_bd_pins blk_mem_gen_twiddle_h_4/addrb]
connect_bd_net [get_bd_pins inPlaceNTT_DIF_preco_0/twiddle_h_rsc_0_3_da] [get_bd_pins blk_mem_gen_twiddle_h_4/dina]
connect_bd_net [get_bd_pins inPlaceNTT_DIF_preco_0/twiddle_h_rsc_0_3_db] [get_bd_pins blk_mem_gen_twiddle_h_4/dinb]
connect_bd_net [get_bd_pins inPlaceNTT_DIF_preco_0/twiddle_h_rsc_0_3_wea] [get_bd_pins blk_mem_gen_twiddle_h_4/wea]
connect_bd_net [get_bd_pins inPlaceNTT_DIF_preco_0/twiddle_h_rsc_0_3_web] [get_bd_pins blk_mem_gen_twiddle_h_4/web]
connect_bd_net [get_bd_pins inPlaceNTT_DIF_preco_0/twiddle_h_rsc_triosy_0_0_lz] [get_bd_pins axi_lit_0/twiddle_h_rsc_triosy_0_0_lz]
connect_bd_net [get_bd_pins inPlaceNTT_DIF_preco_0/twiddle_h_rsc_triosy_0_1_lz] [get_bd_pins axi_lit_0/twiddle_h_rsc_triosy_0_1_lz]
connect_bd_net [get_bd_pins inPlaceNTT_DIF_preco_0/twiddle_h_rsc_triosy_0_2_lz] [get_bd_pins axi_lit_0/twiddle_h_rsc_triosy_0_2_lz]
connect_bd_net [get_bd_pins inPlaceNTT_DIF_preco_0/twiddle_h_rsc_triosy_0_3_lz] [get_bd_pins axi_lit_0/twiddle_h_rsc_triosy_0_3_lz]
connect_bd_net [get_bd_pins inPlaceNTT_DIF_preco_0/twiddle_rsc_0_0_adra] [get_bd_pins blk_mem_gen_twiddle_0/addra]
connect_bd_net [get_bd_pins inPlaceNTT_DIF_preco_0/twiddle_rsc_0_0_adrb] [get_bd_pins blk_mem_gen_twiddle_0/addrb]
connect_bd_net [get_bd_pins inPlaceNTT_DIF_preco_0/twiddle_rsc_0_0_da] [get_bd_pins blk_mem_gen_twiddle_0/dina]
connect_bd_net [get_bd_pins inPlaceNTT_DIF_preco_0/twiddle_rsc_0_0_db] [get_bd_pins blk_mem_gen_twiddle_0/dinb]
connect_bd_net [get_bd_pins inPlaceNTT_DIF_preco_0/twiddle_rsc_0_0_wea] [get_bd_pins blk_mem_gen_twiddle_0/wea]
connect_bd_net [get_bd_pins inPlaceNTT_DIF_preco_0/twiddle_rsc_0_0_web] [get_bd_pins blk_mem_gen_twiddle_0/web]
connect_bd_net [get_bd_pins inPlaceNTT_DIF_preco_0/twiddle_rsc_0_1_adra] [get_bd_pins blk_mem_gen_twiddle_1/addra]
connect_bd_net [get_bd_pins inPlaceNTT_DIF_preco_0/twiddle_rsc_0_1_adrb] [get_bd_pins blk_mem_gen_twiddle_1/addrb]
connect_bd_net [get_bd_pins inPlaceNTT_DIF_preco_0/twiddle_rsc_0_1_da] [get_bd_pins blk_mem_gen_twiddle_1/dina]
connect_bd_net [get_bd_pins inPlaceNTT_DIF_preco_0/twiddle_rsc_0_1_db] [get_bd_pins blk_mem_gen_twiddle_1/dinb]
connect_bd_net [get_bd_pins inPlaceNTT_DIF_preco_0/twiddle_rsc_0_1_wea] [get_bd_pins blk_mem_gen_twiddle_1/wea]
connect_bd_net [get_bd_pins inPlaceNTT_DIF_preco_0/twiddle_rsc_0_1_web] [get_bd_pins blk_mem_gen_twiddle_1/web]
connect_bd_net [get_bd_pins inPlaceNTT_DIF_preco_0/twiddle_rsc_0_2_adra] [get_bd_pins blk_mem_gen_twiddle_2/addra]
connect_bd_net [get_bd_pins inPlaceNTT_DIF_preco_0/twiddle_rsc_0_2_adrb] [get_bd_pins blk_mem_gen_twiddle_2/addrb]
connect_bd_net [get_bd_pins inPlaceNTT_DIF_preco_0/twiddle_rsc_0_2_da] [get_bd_pins blk_mem_gen_twiddle_2/dina]
connect_bd_net [get_bd_pins inPlaceNTT_DIF_preco_0/twiddle_rsc_0_2_db] [get_bd_pins blk_mem_gen_twiddle_2/dinb]
connect_bd_net [get_bd_pins inPlaceNTT_DIF_preco_0/twiddle_rsc_0_2_wea] [get_bd_pins blk_mem_gen_twiddle_2/wea]
connect_bd_net [get_bd_pins inPlaceNTT_DIF_preco_0/twiddle_rsc_0_2_web] [get_bd_pins blk_mem_gen_twiddle_2/web]
connect_bd_net [get_bd_pins inPlaceNTT_DIF_preco_0/twiddle_rsc_0_3_adra] [get_bd_pins blk_mem_gen_twiddle_3/addra]
connect_bd_net [get_bd_pins inPlaceNTT_DIF_preco_0/twiddle_rsc_0_3_adrb] [get_bd_pins blk_mem_gen_twiddle_3/addrb]
connect_bd_net [get_bd_pins inPlaceNTT_DIF_preco_0/twiddle_rsc_0_3_da] [get_bd_pins blk_mem_gen_twiddle_3/dina]
connect_bd_net [get_bd_pins inPlaceNTT_DIF_preco_0/twiddle_rsc_0_3_db] [get_bd_pins blk_mem_gen_twiddle_3/dinb]
connect_bd_net [get_bd_pins inPlaceNTT_DIF_preco_0/twiddle_rsc_0_3_wea] [get_bd_pins blk_mem_gen_twiddle_3/wea]
connect_bd_net [get_bd_pins inPlaceNTT_DIF_preco_0/twiddle_rsc_0_3_web] [get_bd_pins blk_mem_gen_twiddle_3/web]
connect_bd_net [get_bd_pins inPlaceNTT_DIF_preco_0/twiddle_rsc_triosy_0_0_lz] [get_bd_pins axi_lit_0/twiddle_rsc_triosy_0_0_lz]
connect_bd_net [get_bd_pins inPlaceNTT_DIF_preco_0/twiddle_rsc_triosy_0_1_lz] [get_bd_pins axi_lit_0/twiddle_rsc_triosy_0_1_lz]
connect_bd_net [get_bd_pins inPlaceNTT_DIF_preco_0/twiddle_rsc_triosy_0_2_lz] [get_bd_pins axi_lit_0/twiddle_rsc_triosy_0_2_lz]
connect_bd_net [get_bd_pins inPlaceNTT_DIF_preco_0/twiddle_rsc_triosy_0_3_lz] [get_bd_pins axi_lit_0/twiddle_rsc_triosy_0_3_lz]
connect_bd_net [get_bd_pins inPlaceNTT_DIF_preco_0/vec_rsc_0_0_adr] [get_bd_pins blk_mem_gen_vec_0/addrb]
connect_bd_net [get_bd_pins inPlaceNTT_DIF_preco_0/vec_rsc_0_0_d] [get_bd_pins blk_mem_gen_vec_0/dinb]
connect_bd_net [get_bd_pins inPlaceNTT_DIF_preco_0/vec_rsc_0_0_we] [get_bd_pins blk_mem_gen_vec_0/web] [get_bd_pins axi_lit_0/vec_rsc_triosy_0_0_lz]
connect_bd_net [get_bd_pins inPlaceNTT_DIF_preco_0/vec_rsc_0_1_adr] [get_bd_pins blk_mem_gen_vec_1/addrb]
connect_bd_net [get_bd_pins inPlaceNTT_DIF_preco_0/vec_rsc_0_1_d] [get_bd_pins blk_mem_gen_vec_1/dinb]
connect_bd_net [get_bd_pins inPlaceNTT_DIF_preco_0/vec_rsc_0_1_we] [get_bd_pins blk_mem_gen_vec_1/web]
connect_bd_net [get_bd_pins inPlaceNTT_DIF_preco_0/vec_rsc_0_2_adr] [get_bd_pins blk_mem_gen_vec_2/addrb]
connect_bd_net [get_bd_pins inPlaceNTT_DIF_preco_0/vec_rsc_0_2_d] [get_bd_pins blk_mem_gen_vec_2/dinb]
connect_bd_net [get_bd_pins inPlaceNTT_DIF_preco_0/vec_rsc_0_2_we] [get_bd_pins blk_mem_gen_vec_2/web]
connect_bd_net [get_bd_pins inPlaceNTT_DIF_preco_0/vec_rsc_0_3_adr] [get_bd_pins blk_mem_gen_vec_3/addrb]
connect_bd_net [get_bd_pins inPlaceNTT_DIF_preco_0/vec_rsc_0_3_d] [get_bd_pins blk_mem_gen_vec_3/dinb]
connect_bd_net [get_bd_pins inPlaceNTT_DIF_preco_0/vec_rsc_0_3_we] [get_bd_pins blk_mem_gen_vec_3/web]
connect_bd_net [get_bd_pins inPlaceNTT_DIF_preco_0/vec_rsc_0_4_adr] [get_bd_pins blk_mem_gen_vec_4/addrb]
connect_bd_net [get_bd_pins inPlaceNTT_DIF_preco_0/vec_rsc_0_4_d] [get_bd_pins blk_mem_gen_vec_4/dinb]
connect_bd_net [get_bd_pins inPlaceNTT_DIF_preco_0/vec_rsc_0_4_we] [get_bd_pins blk_mem_gen_vec_4/web]
connect_bd_net [get_bd_pins inPlaceNTT_DIF_preco_0/vec_rsc_0_5_adr] [get_bd_pins blk_mem_gen_vec_5/addrb]
connect_bd_net [get_bd_pins inPlaceNTT_DIF_preco_0/vec_rsc_0_5_d] [get_bd_pins blk_mem_gen_vec_5/dinb]
connect_bd_net [get_bd_pins inPlaceNTT_DIF_preco_0/vec_rsc_0_5_we] \
  [get_bd_pins blk_mem_gen_vec_5/web] [get_bd_pins inPlaceNTT_DIF_preco_0/vec_rsc_0_5_q]
connect_bd_net [get_bd_pins inPlaceNTT_DIF_preco_0/vec_rsc_0_6_adr] [get_bd_pins blk_mem_gen_vec_6/addrb]
connect_bd_net [get_bd_pins inPlaceNTT_DIF_preco_0/vec_rsc_0_6_d] [get_bd_pins blk_mem_gen_vec_6/dinb]
connect_bd_net [get_bd_pins inPlaceNTT_DIF_preco_0/vec_rsc_0_6_we] [get_bd_pins blk_mem_gen_vec_6/web]
connect_bd_net [get_bd_pins inPlaceNTT_DIF_preco_0/vec_rsc_0_7_adr] [get_bd_pins blk_mem_gen_vec_7/addrb]
connect_bd_net [get_bd_pins inPlaceNTT_DIF_preco_0/vec_rsc_0_7_d] [get_bd_pins blk_mem_gen_vec_7/dinb]
connect_bd_net [get_bd_pins inPlaceNTT_DIF_preco_0/vec_rsc_0_7_we] [get_bd_pins blk_mem_gen_vec_7/web]
connect_bd_net [get_bd_pins inPlaceNTT_DIF_preco_0/vec_rsc_triosy_0_1_lz] [get_bd_pins axi_lit_0/vec_rsc_triosy_0_1_lz]
connect_bd_net [get_bd_pins inPlaceNTT_DIF_preco_0/vec_rsc_triosy_0_2_lz] [get_bd_pins axi_lit_0/vec_rsc_triosy_0_2_lz]
connect_bd_net [get_bd_pins inPlaceNTT_DIF_preco_0/vec_rsc_triosy_0_3_lz] [get_bd_pins axi_lit_0/vec_rsc_triosy_0_3_lz]
connect_bd_net [get_bd_pins inPlaceNTT_DIF_preco_0/vec_rsc_triosy_0_4_lz] [get_bd_pins axi_lit_0/vec_rsc_triosy_0_4_lz]
connect_bd_net [get_bd_pins inPlaceNTT_DIF_preco_0/vec_rsc_triosy_0_5_lz] [get_bd_pins axi_lit_0/vec_rsc_triosy_0_5_lz]
connect_bd_net [get_bd_pins inPlaceNTT_DIF_preco_0/vec_rsc_triosy_0_6_lz] [get_bd_pins axi_lit_0/vec_rsc_triosy_0_6_lz]
connect_bd_net [get_bd_pins inPlaceNTT_DIF_preco_0/vec_rsc_triosy_0_7_lz] [get_bd_pins axi_lit_0/vec_rsc_triosy_0_7_lz]
connect_bd_net [get_bd_ports refclk] [get_bd_pins axi_pcie3_0/refclk]
connect_bd_net [get_bd_ports sys_rst_n] [get_bd_pins axi_pcie3_0/sys_rst_n]
connect_bd_net [get_bd_pins util_ds_buf_0/IBUF_OUT] [get_bd_pins axi_pcie3_0/sys_clk_gt]

# ---- address map ----
assign_bd_address -offset 0x00000000 -range 2G -target_address_space [get_bd_addr_spaces axi_pcie3_0/M_AXI] [get_bd_addr_segs axi_lit_0/interface_aximm/reg0]
assign_bd_address -offset 0xC0000000 -range 8K -target_address_space [get_bd_addr_spaces axi_pcie3_0/M_AXI] [get_bd_addr_segs axi_bram_ctrl_vec_0/S_AXI/Mem0]
assign_bd_address -offset 0xC2000000 -range 8K -target_address_space [get_bd_addr_spaces axi_pcie3_0/M_AXI] [get_bd_addr_segs axi_bram_ctrl_vec_1/S_AXI/Mem0]
assign_bd_address -offset 0xC4000000 -range 8K -target_address_space [get_bd_addr_spaces axi_pcie3_0/M_AXI] [get_bd_addr_segs axi_bram_ctrl_vec_2/S_AXI/Mem0]
assign_bd_address -offset 0xC6000000 -range 8K -target_address_space [get_bd_addr_spaces axi_pcie3_0/M_AXI] [get_bd_addr_segs axi_bram_ctrl_vec_3/S_AXI/Mem0]
assign_bd_address -offset 0xC8000000 -range 8K -target_address_space [get_bd_addr_spaces axi_pcie3_0/M_AXI] [get_bd_addr_segs axi_bram_ctrl_vec_5/S_AXI/Mem0]
assign_bd_address -offset 0xCA000000 -range 8K -target_address_space [get_bd_addr_spaces axi_pcie3_0/M_AXI] [get_bd_addr_segs axi_bram_ctrl_vec_6/S_AXI/Mem0]
assign_bd_address -offset 0xCC000000 -range 8K -target_address_space [get_bd_addr_spaces axi_pcie3_0/M_AXI] [get_bd_addr_segs axi_bram_ctrl_vec_7/S_AXI/Mem0]
assign_bd_address -offset 0xCE000000 -range 8K -target_address_space [get_bd_addr_spaces axi_pcie3_0/M_AXI] [get_bd_addr_segs axi_bram_ctrl_vec_4/S_AXI/Mem0]

validate_bd_design
save_bd_design
